# EAGLE schematic ESP-WROOM-32-Breakout (EAGLE 9.3.0)
REV: 1
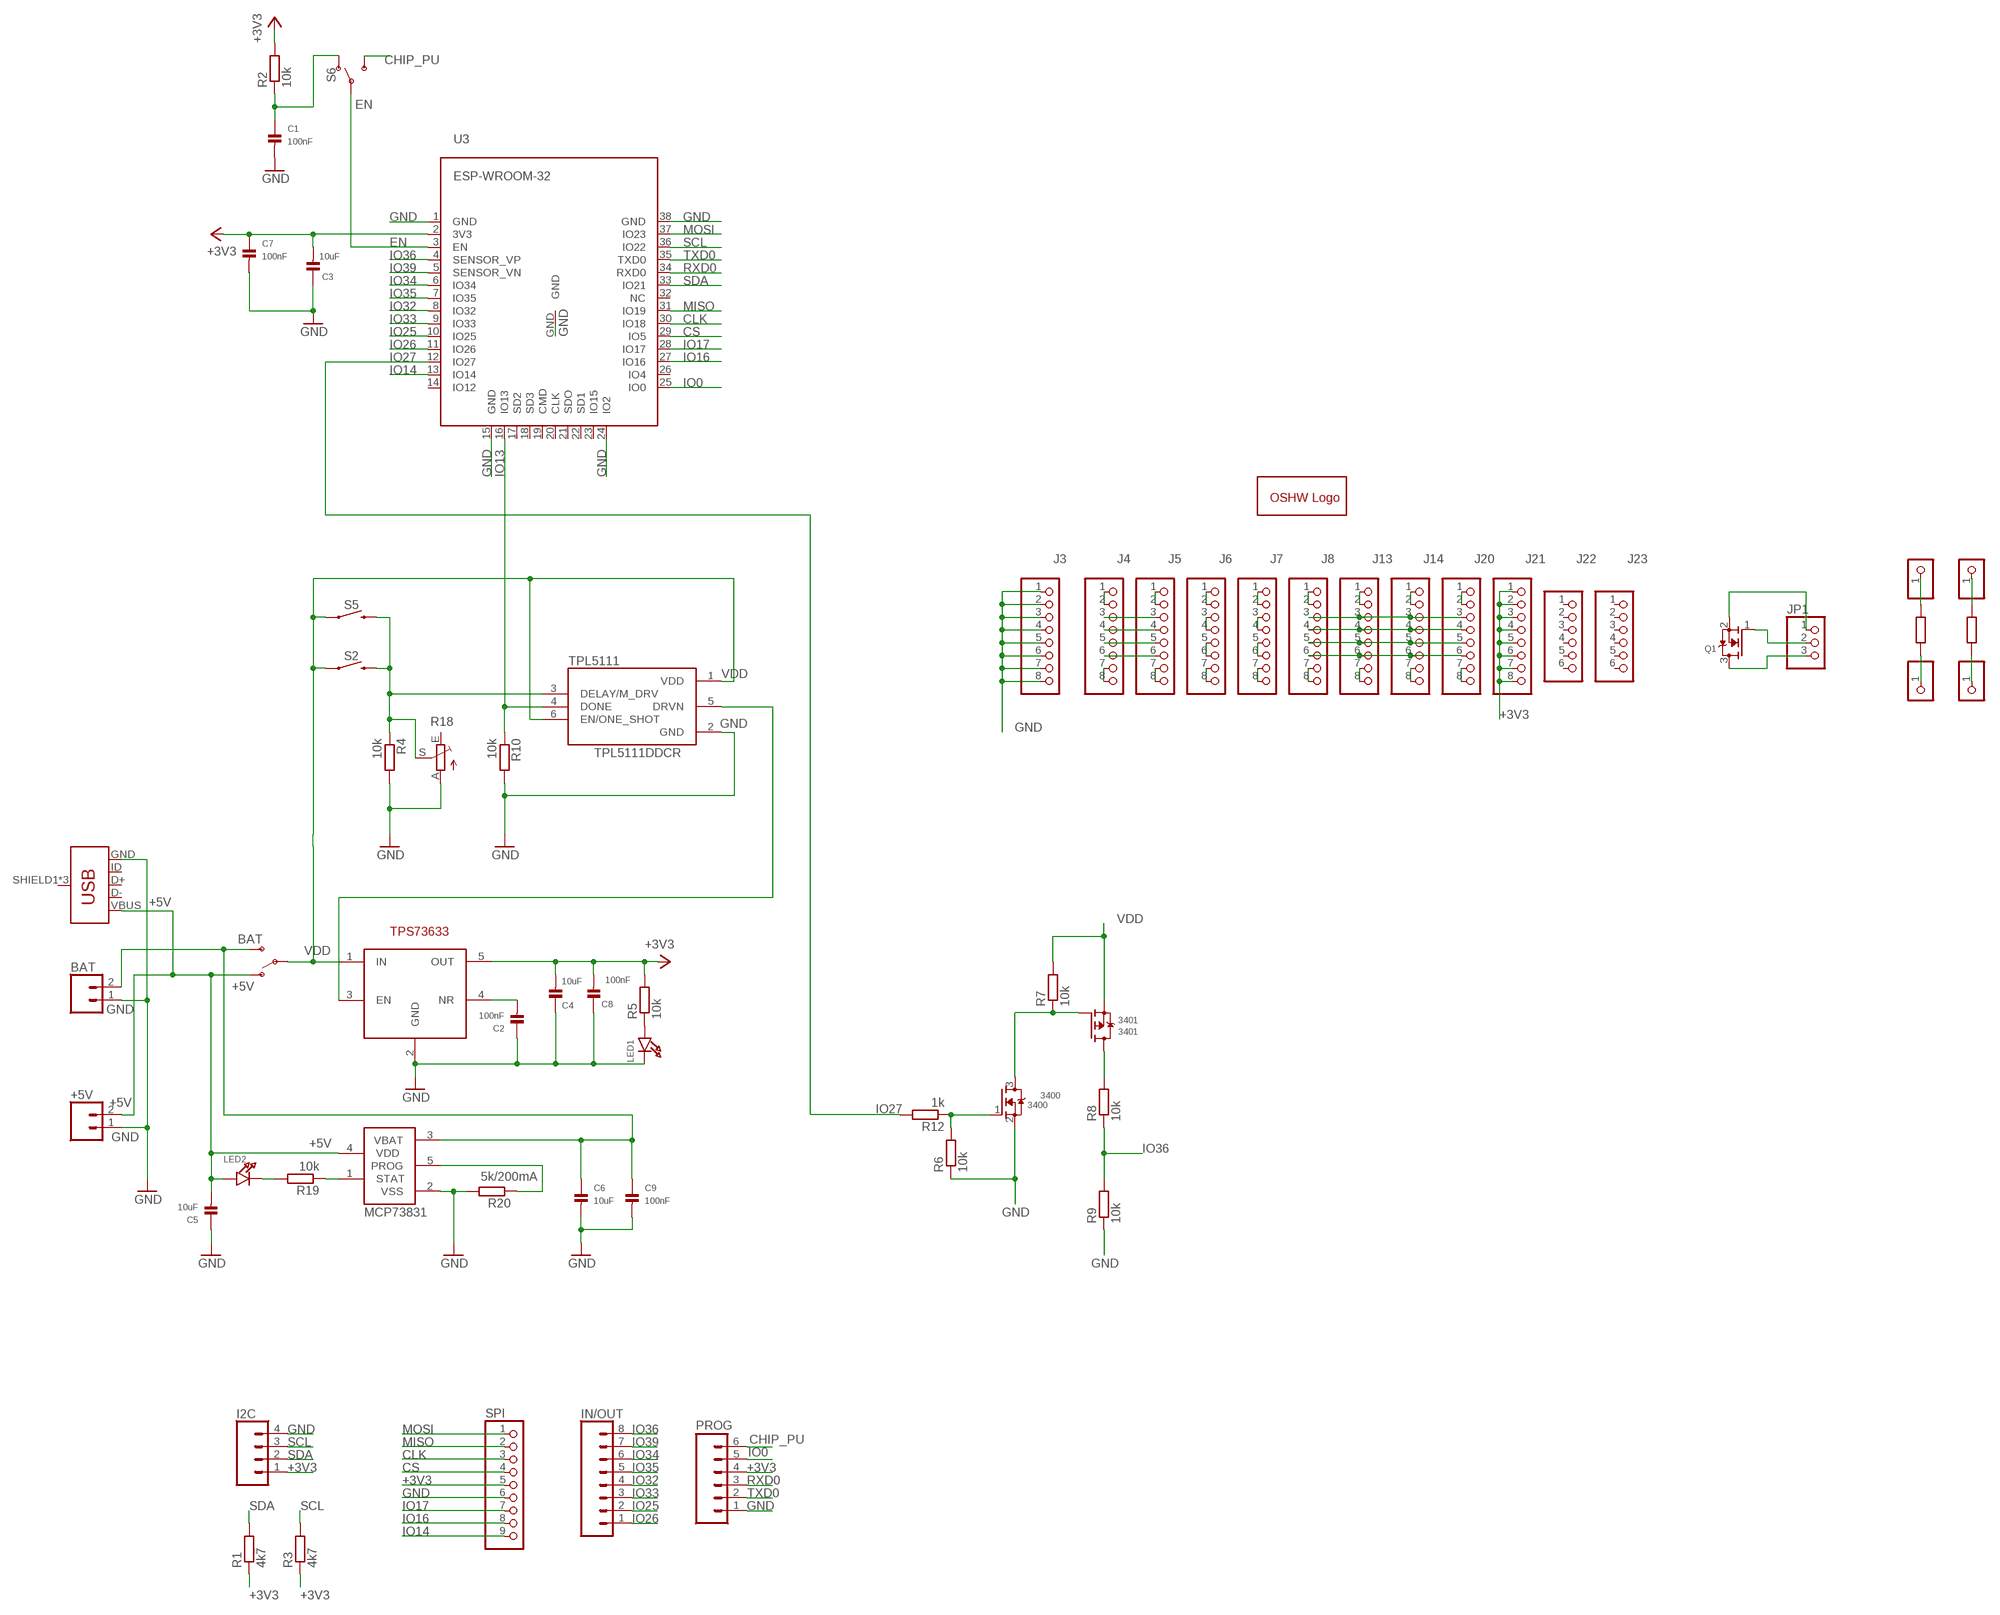
[diagram p0: schematic, sheet 1]

## Parts
3400  3400  MOSFET-NWIDE  [SOT23-WIDE]
3401  3401  MOSFET-PWIDE  [SOT23-WIDE]
+5V  CONN_02  [1X02]
BAT  CONN_02  [1X02]
C1  100nF  CAP_CERAMIC1206  [1206]
C2  100nF  CAP_CERAMIC1206  [1206]
C3  10uF  CAP_CERAMIC1206  [1206]
C4  10uF  CAP_CERAMIC1206  [1206]
C5  10uF  CAP_CERAMIC1206  [1206]
C6  10uF  CAP_CERAMIC1206  [1206]
C7  100nF  CAP_CERAMIC1206  [1206]
C8  100nF  CAP_CERAMIC1206  [1206]
C9  100nF  CAP_CERAMIC1206  [1206]
GOLD_ORB_SM1  OSHWLOGOLOGO8MM  [OSHW_8MM]
I2C  CONN_041X04_NO_SILK  [1X04_NO_SILK]
IN/OUT  CONN_08NO_SILK_FEMALE_PTH  [1X08_NO_SILK]
J1  USB_MICRO-B_FEMALE-SMT  [USB-B-MICRO-SMD]
J3  HEADER-1X8ROUND  [1X08_ROUND]
J4  HEADER-1X8ROUND  [1X08_ROUND]
J5  HEADER-1X8ROUND  [1X08_ROUND]
J6  HEADER-1X8ROUND  [1X08_ROUND]
J7  HEADER-1X8ROUND  [1X08_ROUND]
J8  HEADER-1X8ROUND  [1X08_ROUND]
J13  HEADER-1X8ROUND  [1X08_ROUND]
J14  HEADER-1X8ROUND  [1X08_ROUND]
J20  HEADER-1X8ROUND  [1X08_ROUND]
J21  HEADER-1X8ROUND  [1X08_ROUND]
J22  HEADER-1X670MIL  [1X06_ROUND_70]
J23  HEADER-1X670MIL  [1X06_ROUND_70]
JP1  HEADER-1X376MIL  [1X03_ROUND_76]
JP2  HEADER-1X12MM  [1X01_2MM]
JP3  HEADER-1X12MM  [1X01_2MM]
JP4  HEADER-1X12MM  [1X01_2MM]
JP5  HEADER-1X12MM  [1X01_2MM]
LED1  LED1206  [CHIPLED_1206]
LED2  LED1206  [CHIPLED_1206]
PROG  CONN_06NO_SILK_NO_POP  [1X06_NO_SILK]
Q1  MOSFET-NWIDE  [SOT23-WIDE]
R1  4k7  R-EU_R1206  [R1206]
R2  10k  R-EU_R1206  [R1206]
R3  4k7  R-EU_R1206  [R1206]
R4  10k  R-EU_R1206  [R1206]
R5  10k  R-EU_R1206  [R1206]
R6  10k  R-EU_R1206  [R1206]
R7  10k  R-EU_R1206  [R1206]
R8  10k  R-EU_R1206  [R1206]
R9  10k  R-EU_R1206  [R1206]
R10  10k  R-EU_R1206  [R1206]
R11  10k  R-EU_R1206  [R1206]
R12  1k  R-EU_R1206  [R1206]
R13  10k  R-EU_R1206  [R1206]
R18  TRIM_EU-CT6  [CT6]
R19  10k  R-EU_R1206  [R1206]
R20  5k/200mA  R-EU_R1206  [R1206]
S2  MOMENTARY-SWITCH-SPST-SMD-6.2MM-TALL  [TACTILE_SWITCH_SMD_6.2MM_TALL]
S3  SWITCH-SPDT-PTH-11.6X4.0MM  [SWITCH_SPDT_PTH_11.6X4.0MM]
S5  MOMENTARY-SWITCH-SPST-PTH-RIGHT-ANGLE-KIT  [TACTILE_SWITCH_PTH_RIGHT_ANGLE_KIT]
S6  SWITCH-SPDT-PTH-11.6X4.0MM  [SWITCH_SPDT_PTH_11.6X4.0MM]
SPI  HEADER-1X970MIL  [1X09_ROUND_70]
TPL5111  TPL5111DDCR  [SOT95P280X110-6N]
TPS73633  TPS73633DBVR  [SOT23-DBV]
U3  ESP-WROOM-32  [ESP-WROOM-32]
U$1  MCP73831  [SOT23-5L]

## Nets
+3V3: C3.2 C4.2 C7.1 C8.2 I2C.1 J21.1 J21.2 J21.3 J21.4 J21.5 J21.6 J21.7 J21.8 PROG.4 R1.1 R2.2 R3.1 R5.2 SPI.5 TPS73633.5(OUT) U3.2(3V3)
+5V: +5V.2 C5.2 J1.VBUS LED2.A S3.1(O) U$1.4(VDD)
BAT: BAT.2 C6.1 C9.1 S3.3(S) U$1.3(VBAT)
CHIP_PU: PROG.6 S6.3(S)
CLK: SPI.3 U3.30(IO18)
CS: SPI.4 U3.29(IO5)
EN: S6.2(P) U3.3(EN)
GND [gnd]: 3400.2(S) +5V.1 BAT.1 C1.2 C2.1 C3.1 C4.1 C5.1 C6.2 C7.2 C8.1 C9.2 I2C.4 J1.GND J3.1 J3.2 J3.3 J3.4 J3.5 J3.6 J3.7 J3.8 LED1.C PROG.1 R4.2 R6.1 R9.1 R10.2 R18.A R20.2 SPI.6 TPL5111.2(GND) TPS73633.2(GND) U3.1(GND) U3.15(GND) U3.24(IO2) U3.38(GND) U3.GND U$1.2(VSS)
IO0: PROG.5 U3.25(IO0)
IO13: R10.1 TPL5111.4(DONE) U3.16(IO13)
IO14: SPI.9 U3.13(IO14)
IO16: SPI.8 U3.27(IO16)
IO17: SPI.7 U3.28(IO17)
IO25: IN/OUT.2 U3.10(IO25)
IO26: IN/OUT.1 U3.11(IO26)
IO27: R12.2 U3.12(IO27)
IO32: IN/OUT.4 U3.8(IO32)
IO33: IN/OUT.3 U3.9(IO33)
IO34: IN/OUT.6 U3.6(IO34)
IO35: IN/OUT.5 U3.7(IO35)
IO36: IN/OUT.8 R8.1 R9.2 U3.4(SENSOR_VP)
IO39: IN/OUT.7 U3.5(SENSOR_VN)
MISO: SPI.2 U3.31(IO19)
MOSI: SPI.1 U3.37(IO23)
N$1: TPL5111.5(DRVN) TPS73633.3(EN)
N$2: JP1.1 Q1.2(S)
N$3: C2.2 TPS73633.4(NR)
N$4: R4.1 R18.S S2.B2 S5.2 TPL5111.3(DELAY/M_DRV)
N$5: LED1.A R5.1
N$6: JP1.2 Q1.1(G)
N$7: JP1.3 Q1.3(D)
N$8: 3400.3(D) 3401.1(G) R7.1
N$9: JP2.1 R11.2
N$10: 3401.3(D) R8.2
N$11: JP3.1 R11.1
N$12: JP4.1 R13.2
N$13: JP5.1 R13.1
N$15: C1.1 R2.1 S6.1(O)
N$16: R19.1 U$1.1(STAT)
N$18: 3400.1(G) R6.2 R12.1
N$19: J4.1 J4.2
N$20: J5.1 J5.2
N$21: J4.3 J5.3
N$22: J4.4 J5.4
N$23: J4.5 J5.5
N$24: J4.6 J5.6
N$25: J4.7 J4.8
N$26: J5.7 J5.8
N$27: J7.1 J7.2
N$28: J7.3 J7.4
N$29: J7.5 J7.6
N$30: J7.7 J7.8
N$31: J8.7 J8.8
N$32: R20.1 U$1.5(PROG)
N$34: J20.7 J20.8
N$36: J6.3 J6.4
N$37: J8.1 J8.2
N$38: J6.1 J6.2
N$44: J13.1 J13.2
N$45: J8.3 J13.3 J14.3 J20.3
N$46: J8.4 J13.4 J14.4 J20.4
N$47: J8.5 J13.5 J14.5 J20.5
N$48: J8.6 J13.6 J14.6 J20.6
N$49: J6.7 J6.8
N$50: J13.7 J13.8
N$51: J14.7 J14.8
N$52: J14.1 J14.2
N$53: J20.1 J20.2
N$54: J6.5 J6.6
N$68: LED2.C R19.2
RXD0: PROG.3 U3.34(RXD0)
SCL: I2C.3 R3.2 U3.36(IO22)
SDA: I2C.2 R1.2 U3.33(IO21)
TXD0: PROG.2 U3.35(TXD0)
VDD [vcc]: 3401.2(S) R7.2 S2.A2 S3.2(P) S5.1 TPL5111.1(VDD) TPL5111.6(EN/ONE_SHOT) TPS73633.1(IN)
Unconnected: J1.D+ J1.D- J1.ID J1.SHIELD1(SHIELD) J1.SHIELD2(SHIELD) J1.SHIELD3(SHIELD) J22.1 J22.2 J22.3 J22.4 J22.5 J22.6 J23.1 J23.2 J23.3 J23.4 J23.5 J23.6 R18.E U3.14(IO12) U3.17(SD2) U3.18(SD3) U3.19(CMD) U3.20(CLK) U3.21(SDO) U3.22(SD1) U3.23(IO15) U3.26(IO4) U3.32(NC)

## Library data of the parts
3400 Q1 = microbuilder:MOSFET-N: N-Channel Mosfet LEGEND VDS: Voltage Drain-Source ID: Drain Current RDS(ON): Drain-Source On-State Resistance VGS(TH): Gate-Source Threshold Voltage CISS: Drain-Source Input Capacitance SOT-23 Name VDS ID RDS(ON) VGS(TH) CISS Order Number 2N7002E 60V 260mA 2.5 Ohm 2.5V @ 250uA 26.7pF @ 25V 2N7002ET1GOSTR-ND BSH103 30V 850mA 400 mOhm 400mV @ 1mA 83pF @ 24V BSH103,235-ND BSS138 60V 320mA 1.6 Ohm 1.5V @ 250uA 50pF @ 10V Mouser: 771-BSS138PW115 DMN2075U-7 20V 4.2A 38 mOhm 1V @ 250 uA 594.3pF @ 10V DMN2075U-7DICT-ND * BSS138 good choice for I2C level-shifting
3401 = microbuilder:MOSFET-P: P-Channel Mosfet LEGEND VDS: Voltage Drain-Source ID: Drain Current RDS(ON): Drain-Source On-State Resistance VGS(TH): Gate-Source Threshold Voltage CISS: Drain-Source Input Capacitance SOT-23 Name VDS ID RDS(ON) VGS(TH) CISS Order Number IRLML5103 30V 760mA 600 mOhm -- 75pF @ 25V Digikey: IRLML5103PBFCT-ND IRLML6401 12V 4.3A 50 mOhm 950mV @ 250µA 830pF @ 10V Digikey: IRLML6401PBFTR-ND NTR0202PL 20V 400mA 800 mOhm 2.3V @ 250uA 70pF @ 5V Digikey: NTR0202PLT1GOSTR-ND NTR4101PT1G 20V 1.8A 85 mOhm 1.2V @ 250uA 675pF @ 10V Digikey: NTR4101PT1GOSCT-ND DMP2004K 20V 600mA 900 mOhm 1V @ 250uA 175pF @ 16V Digikey: DMP2004KDICT-ND PMV65XP 20V 3.9A 76 mOhm 950mV @ 1mA 725pF @ 20V Digikey: 568-2358-2-ND TO-252 Name VDS ID RDS(ON) VGS(TH) CISS Order Number AOD417 30V 25A 34 mOhm 3V @ 250µA 920pF @ 15V Digikey: 785-1106-2-ND
+5V BAT = SparkFun-Connectors:CONN_02: Multi connection point. Often used as Generic Header-pin footprint for 0.1 inch spaced/style header connections On any of the 0.1 inch spaced packages, you can populate with these: Break Away Headers - Straight <https://www.sparkfun.com/products/116> (PRT-00116) Break Away Male Headers - Right Angle <https://www.sparkfun.com/products/553> (PRT-00553) Female Headers <https://www.sparkfun.com/products/115> (PRT-00115) Break Away Headers - Machine Pin <https://www.sparkfun.com/products/117> (PRT-00117) Break Away Female Headers - Swiss Machine Pin <https://www.sparkfun.com/products/743> (PRT-00743) For SCREWTERMINALS and SPRING TERMINALS visit here: Screw Terimnals on SparkFun.com <https://www.sparkfun.com/search/results?term=Screw+Terminals> (5mm/3.5mm/2.54mm spacing) This device is also useful as a general connection point to wire up your design to another part of your project. Our various solder wires solder well into these plated through hole pads. Hook-Up Wire - Assortment (Stranded, 22 AWG) <https://www.sparkfun.com/products/11375> (PRT-11375) Hook-Up Wire - Assortment (Solid Core, 22 AWG) <https://www.sparkfun.com/products/11367> (PRT-11367) View the entire wire category on our website here <https://www.sparkfun.com/categories/141> Special notes: Molex polarized connector foot print use with: PRT-08233 with associated crimp pins and housings. 2.54_SCREWTERM for use with PRT-10571. 3.5mm Screw Terminal footprints for PRT-08084 5mm Screw Terminal footprints for use with PRT-08432
C1-C9 = microbuilder:CAP_CERAMIC: Ceramic Capacitors 0402 - 0402 Surface Mount Capacitors 16pF 50V 5% [Digikey: 445-4899-2-ND] 18pF 50V 5% [Digikey: 490-1281-2-ND] 22pF 50V 5% [Digikey: 490-1283-2-ND] 68pF 50V 5% [Digikey: 490-1289-2-ND] 0.1uF 10V 10% [Digikey: 490-1318-2-ND] 1.0uF 6.3V 10% [Digikey: 490-1320-2-ND] 0603 - 0603 Surface Mount Capacitors 16 pF 50V 5% [Digikey: 445-5051-2-ND] 22 pF 50V [Digikey: PCC220ACVTR-ND] 33 pF 50V 5% [Digikey: 490-1415-1-ND] 56pF 50V 5% [Digikey: 490-1421-1-ND] 220pF 50V 5% [Digikey: 445-1285-1-ND] 680 pF 50V 2200 pF 50V 5% C0G [Digikey: 445-1297-1-ND] 5600 pF 100V 5% X7R [Digikey: 478-3711-1-ND] 0.1 µF 25V 10% [Digikey: PCC2277TR-ND] 0.22 µF 16V 10% X7R [Digikey: 445-1318-1-ND] 1.0 µF 25V 10% [Digikey: 445-5146-2-ND] 0603 - RF Specific 3pF 250V +/-0.1pF RF [Digikey: 712-1347-1-ND] 18 pF 250V 5% [Digikey: 478-3505-1-ND or 712-1322-1-ND] 56 pF 250V 5% C0G RF [Digikey: 490-4867-1-ND] 68 pF 250V RF [Digikey: 490-4868-1-ND] 0805 - 0805 Surface Mount Capacitors 220 pF 250V 2% RF Ceramic Capacitor [Digikey: 712-1398-1-ND] 1000 pF 50V 2% NP0 Ceramic Capacitor [Digikey: 478-3760-1-ND] 0.1 µF 25V 10% Ceramic Capacitor [Digikey: PCC1828TR-ND] 1.0 µF 16V 10% Ceramic Capacitor[Digikey: 490-1691-2-ND] 10.0 µF 10V 10% Ceramic Capacitor[Digikey: 709-1228-1-ND] 10.0 uF 16V 10% Ceramic Capacitor [Digikey: 478-5165-2-ND] 47 uF 6.3V 20% Ceramic Capacitor [Digikey: 587-1779-1-ND or 399-5506-1-ND] 1206 - 1206 Surface Mount Capacitors 47uF 10V 20% Ceramic Capacitor [Digikey: 490-5528-1-ND or 399-5508-1-ND or 445-6010-1-ND] 100uF 6.3V -20%, +80% Y5V Ceramic Capacitor (Digikey: 490-4512-1-ND, Mouser: 81-GRM31CF50J107ZE1L)
GOLD_ORB_SM1 = oshw:OSHWLOGO: The OSHW logo for PCB layout
I2C = SparkFun-Connectors:CONN_04: Multi connection point. Often used as Generic Header-pin footprint for 0.1 inch spaced/style header connections On any of the 0.1 inch spaced packages, you can populate with these: Break Away Headers - Straight <https://www.sparkfun.com/products/116> (PRT-00116) Break Away Male Headers - Right Angle <https://www.sparkfun.com/products/553> (PRT-00553) Female Headers <https://www.sparkfun.com/products/115> (PRT-00115) Break Away Headers - Machine Pin <https://www.sparkfun.com/products/117> (PRT-00117) Break Away Female Headers - Swiss Machine Pin <https://www.sparkfun.com/products/743> (PRT-00743) For SCREWTERMINALS and SPRING TERMINALS visit here: Screw Terimnals on SparkFun.com <https://www.sparkfun.com/search/results?term=Screw+Terminals> (5mm/3.5mm/2.54mm spacing) This device is also useful as a general connection point to wire up your design to another part of your project. Our various solder wires solder well into these plated through hole pads. Hook-Up Wire - Assortment (Stranded, 22 AWG) <https://www.sparkfun.com/products/11375> (PRT-11375) Hook-Up Wire - Assortment (Solid Core, 22 AWG) <https://www.sparkfun.com/products/11367> (PRT-11367) View the entire wire category on our website here <https://www.sparkfun.com/categories/141> Special notes: Molex polarized connector foot print use with SKU : PRT-08231 with associated crimp pins and housings. 1MM SMD Version SKU: PRT-10208; PROD_ID: CONN-09696
IN/OUT = SparkFun-Connectors:CONN_08: Multi connection point. Often used as Generic Header-pin footprint for 0.1 inch spaced/style header connections On any of the 0.1 inch spaced packages, you can populate with these: Break Away Headers - Straight <https://www.sparkfun.com/products/116> (PRT-00116) Break Away Male Headers - Right Angle <https://www.sparkfun.com/products/553> (PRT-00553) Female Headers <https://www.sparkfun.com/products/115> (PRT-00115) Break Away Headers - Machine Pin <https://www.sparkfun.com/products/117> (PRT-00117) Break Away Female Headers - Swiss Machine Pin <https://www.sparkfun.com/products/743> (PRT-00743) Arduino Stackable Header - 8 Pin <https://www.sparkfun.com/products/9279> (PRT-09279) For SCREWTERMINALS and SPRING TERMINALS visit here: Screw Terimnals on SparkFun.com <https://www.sparkfun.com/search/results?term=Screw+Terminals> (5mm/3.5mm/2.54mm spacing) This device is also useful as a general connection point to wire up your design to another part of your project. Our various solder wires solder well into these plated through hole pads. Hook-Up Wire - Assortment (Stranded, 22 AWG) <https://www.sparkfun.com/products/11375> (PRT-11375) Hook-Up Wire - Assortment (Solid Core, 22 AWG) <https://www.sparkfun.com/products/11367> (PRT-11367) View the entire wire category on our website here <https://www.sparkfun.com/categories/141> Special notes: Molex polarized connector foot print use with SKU : PRT-08231 with associated crimp pins and housings. 1MM SMD Version SKU: PRT-10208 NOTES ON THE VARIANTS LOCK and LOCK_LONGPADS... This footprint was designed to help hold the alignment of a through-hole component (i.e. 6-pin header) while soldering it into place. You may notice that each hole has been shifted either up or down by 0.005 of an inch from it's more standard position (which is a perfectly straight line). This slight alteration caused the pins (the squares in the middle) to touch the edges of the holes. Because they are alternating, it causes a "brace" to hold the component in place. 0.005 has proven to be the perfect amount of "off-center" position when using our standard breakaway headers. Although looks a little odd when you look at the bare footprint, once you have a header in there, the alteration is very hard to notice. Also,if you push a header all the way into place, it is covered up entirely on the bottom side.; PROD_ID: CONN-08438
J1 = SparkFun-Connectors:USB_MICRO-B: USB Type Micro-B Connector Male/female and PTH/SMT variants SparkFun Products: SparkFun microB USB Breakout <https://www.sparkfun.com/products/12035> SparkFun USB microB Plug Breakout <https://www.sparkfun.com/products/10031> SparkFun ESP8266 Thing <https://www.sparkfun.com/products/13231>; PROD_ID: CONN-11752
J3-J8 J13 J14 J20 J21 = microbuilder:HEADER-1X8: PIN HEADER
J22 J23 = microbuilder:HEADER-1X6: PIN HEADER
JP1 = microbuilder:HEADER-1X3: PIN HEADER
JP2-JP5 = microbuilder:HEADER-1X1: PIN HEADER
LED1 LED2 = microbuilder:LED: LED 0603 - 0603 Surface Mount Package 2mA: Green LED - Low Power (3.9mcd, 2ma, 1.7Vf) - Digikey: 475-2709-2-ND Orange LED - Low Power (9.8mcd, 2ma, 1.8Vf) - Digikey: 475-1194-2-ND Red LED - Low Power (5mcd, 2ma, 1.8Vf) - Digikey: 475-1195-2-ND Yellow LED - Low Power (7mcd, 2ma, 1.8Vf) - Digikey: 475-1196-2-ND 5mA: Blue LED - Low Power (17mcd, 5ma, 2.9Vf) - Digikey: LNJ937W8CRACT-ND 0805 - 0805 Surface Mount Package 2mA: Red LED (8.8mcd, 2mA, 1.8Vf, Clear) - Low Power [Digikey: 475-2510-1-ND] Green LED (5mcd, 2mA, 1.8Vf, Clear) - Low Power [Digikey: 475-2730-1-ND] Yellow LED (11.3mcd, 2mA, 1.8Vf, Clear) - Low Power [Digikey: 475-2555-1-ND] 20mA: Red LED (104mcd, 20mA, Diffused) - LS R976 [Digikey: 475-1278-6-ND] Red LED (12mcd, 20mA, 2.0Vf, Clear) - APT2012EC [Digikey: 754-1128-1-ND] Green LED (15mcd, 20mA, 2.2Vf, Clear) - APT2012GC [Digikey: 754-1131-1-ND] Orange LED (160mcd, 20mA, 2.1Vf, Clear) - APT2012SECK [Digikey: 754-1130-1-ND] 1206 - 1206 Surface Mount Package Green LED (26mcd, 20mA, Diffused) - LG N971 [Digikey: 475-1407-6-ND] Red LED (15mcd, 20mA, Diffused) - LH N974 [Digikey: 475-1416-6-ND]
PROG = SparkFun-Connectors:CONN_06: Multi connection point. Often used as Generic Header-pin footprint for 0.1 inch spaced/style header connections On any of the 0.1 inch spaced packages, you can populate with these: Break Away Headers - Straight <https://www.sparkfun.com/products/116> (PRT-00116) Break Away Male Headers - Right Angle <https://www.sparkfun.com/products/553> (PRT-00553) Female Headers <https://www.sparkfun.com/products/115> (PRT-00115) Break Away Headers - Machine Pin <https://www.sparkfun.com/products/117> (PRT-00117) Break Away Female Headers - Swiss Machine Pin <https://www.sparkfun.com/products/743> (PRT-00743) Arduino Stackable Header - 6 Pin <https://www.sparkfun.com/products/9280> (PRT-09280) For SCREWTERMINALS and SPRING TERMINALS visit here: Screw Terimnals on SparkFun.com <https://www.sparkfun.com/search/results?term=Screw+Terminals> (5mm/3.5mm/2.54mm spacing) This device is also useful as a general connection point to wire up your design to another part of your project. Our various solder wires solder well into these plated through hole pads. Hook-Up Wire - Assortment (Stranded, 22 AWG) <https://www.sparkfun.com/products/11375> (PRT-11375) Hook-Up Wire - Assortment (Solid Core, 22 AWG) <https://www.sparkfun.com/products/11367> (PRT-11367) View the entire wire category on our website here <https://www.sparkfun.com/categories/141>
R1-R13 R19 R20 = rcl:R-EU_: RESISTOR, European symbol; SPICEPREFIX: R
R18 = pot:TRIM_EU-: POTENTIOMETER
S2 = SparkFun-Switches:MOMENTARY-SWITCH-SPST: Momentary Switch (Pushbutton) - SPST Normally-open (NO) SPST momentary switches (buttons, pushbuttons). Variants PTH-12MM - 12mm square, through-hole Momentary Pushbutton Switch - 12mm Square <https://www.sparkfun.com/products/9190> (COM-09190) PTH-6.0MM, PTH-6.0MM-KIT - 6.0mm square, through-hole Mini Pushbutton Switch <https://www.sparkfun.com/products/97> (COM-00097) KIT package intended for soldering kit's - only one side of pads' copper is exposed. PTH-RIGHT-ANGLE-KIT - Right-angle, through-hole Right Angle Tactile Button <https://www.sparkfun.com/products/10791> - Used on SparkFun BigTime Watch Kit <https://www.sparkfun.com/products/11734> SMD-12MM - 12mm square, surface-mount Tactile Button - SMD (12mm) <https://www.sparkfun.com/products/12993> (COM-12993) Used on SparkFun PicoBoard <https://www.sparkfun.com/products/11888> SMD-4.5MM - 4.5mm Square Trackball Switch Used on SparkFun Blackberry Trackballer Breakout <https://www.sparkfun.com/products/13169> SMD-4.6MMX2.8MM - 4.60mm x 2.80mm, surface mount Used on SparkFun SAMD21 Mini Breakout <https://www.sparkfun.com/products/13664> SMD-5.2MM, SMD-5.2-REDUNDANT - 5.2mm square, surface-mount Mini Pushbutton Switch - SMD <https://www.sparkfun.com/products/8720> (COM-08720) Used on Arduino Pro Mini <https://www.sparkfun.com/products/11114> REDUNDANT package connects both switch circuits together SMD-6.0X3.5MM - 6.0 x 3.5mm, surface mount Momentary Reset Switch SMD <https://www.sparkfun.com/products/8229> (COM-08229) SMD-6.2MM-TALL - 6.2mm square, surface mount Tactile Button - SMD (6mm) <https://www.sparkfun.com/products/12992> Used on SparkFun Digital Sandbox <https://www.sparkfun.com/products/12651> SMD-RIGHT-ANGLE - Right-angle, surface mount Used on SparkFun Block for Intel® Edison - Arduino <https://www.sparkfun.com/products/13036>; PROD_ID: SWCH-11966; SF_SKU: COM-12992
S3 S6 = SparkFun-Switches:SWITCH-SPDT: Single Pole, Double Throw (SPDT) Switch Single-pole, double-throw (SPDT) switch. Variant Overview SMD-AYZ0202 Surface Mount DPDT Switch <https://www.sparkfun.com/products/597> (COM-00597) Used on e.g. LilyPad Arduino USB - ATmega32U4 Board <https://www.sparkfun.com/products/12049> PTH-11.6X4.0MM SPDT Mini Power Switch <https://www.sparkfun.com/products/102> (COM-00102) Used on e.g. SparkFun Simon Says - Through-Hole Soldering Kit <https://www.sparkfun.com/products/10547> (KIT-10547) PTH-11.6X4.0MM-KIT KIT version of SPDT Mini Power Switch - Simplifies soldering by removing tStop of switch pins - only one side can be soldered. PTH-11.6X4.0MM-LOCK LOCK version of SPDT Mini Power Switch - Offset pins hold switch in place for easier soldering. SMD-RIGHT-ANGLE Surface Mount Right Angle Switch <https://www.sparkfun.com/products/10860> (COM-10860) Used on e.g. SparkFun ESP8266 Thing <https://www.sparkfun.com/products/13231>; PROD_ID: SWCH-08261; SF_SKU: COM-00102
S5 = SparkFun-Switches:MOMENTARY-SWITCH-SPST: Momentary Switch (Pushbutton) - SPST Normally-open (NO) SPST momentary switches (buttons, pushbuttons). Variants PTH-12MM - 12mm square, through-hole Momentary Pushbutton Switch - 12mm Square <https://www.sparkfun.com/products/9190> (COM-09190) PTH-6.0MM, PTH-6.0MM-KIT - 6.0mm square, through-hole Mini Pushbutton Switch <https://www.sparkfun.com/products/97> (COM-00097) KIT package intended for soldering kit's - only one side of pads' copper is exposed. PTH-RIGHT-ANGLE-KIT - Right-angle, through-hole Right Angle Tactile Button <https://www.sparkfun.com/products/10791> - Used on SparkFun BigTime Watch Kit <https://www.sparkfun.com/products/11734> SMD-12MM - 12mm square, surface-mount Tactile Button - SMD (12mm) <https://www.sparkfun.com/products/12993> (COM-12993) Used on SparkFun PicoBoard <https://www.sparkfun.com/products/11888> SMD-4.5MM - 4.5mm Square Trackball Switch Used on SparkFun Blackberry Trackballer Breakout <https://www.sparkfun.com/products/13169> SMD-4.6MMX2.8MM - 4.60mm x 2.80mm, surface mount Used on SparkFun SAMD21 Mini Breakout <https://www.sparkfun.com/products/13664> SMD-5.2MM, SMD-5.2-REDUNDANT - 5.2mm square, surface-mount Mini Pushbutton Switch - SMD <https://www.sparkfun.com/products/8720> (COM-08720) Used on Arduino Pro Mini <https://www.sparkfun.com/products/11114> REDUNDANT package connects both switch circuits together SMD-6.0X3.5MM - 6.0 x 3.5mm, surface mount Momentary Reset Switch SMD <https://www.sparkfun.com/products/8229> (COM-08229) SMD-6.2MM-TALL - 6.2mm square, surface mount Tactile Button - SMD (6mm) <https://www.sparkfun.com/products/12992> Used on SparkFun Digital Sandbox <https://www.sparkfun.com/products/12651> SMD-RIGHT-ANGLE - Right-angle, surface mount Used on SparkFun Block for Intel® Edison - Arduino <https://www.sparkfun.com/products/13036>; PROD_ID: CONN-10672; SF_SKU: COM-10791
SPI = microbuilder:HEADER-1X9: PIN HEADER
TPL5111 = TPL5111DDCR:TPL5111DDCR: Ultra Low Power System Timer (35 nA) for Power Gating in duty cycled applications 6-SOT -40 to 105; DESCRIPTION: Ultra Low Power System Timer _35 nA_ for Power Gating in duty cycled applications 6-SOT -40 to 105; DIGI-KEY_PART_NUMBER: 296-46226-1-ND; DIGI-KEY_PURCHASE_URL: https://www.digikey.com.ua/product-detail/en/texas-instruments/TPL5111DDCR/296-46226-1-ND/7033401?utm_source=snapeda&utm_medium=aggregator&utm_campaign=symbol; MF: Texas Instruments; MP: TPL5111DDCR; PACKAGE: SOT-23 Texas Instruments
TPS73633 = TPS73633DBVR:TPS73633DBVR: 3.3V LDO regulator. Package footprint not verified!!; DESCRIPTION: Single Output LDO, 400mA, Adj._1.2 to 5.5V_, Cap free, Low Noise, Reverse Current Protection 5-SOT-23 -40 to 125; DIGI-KEY_PART_NUMBER: 296-27064-1-ND; DIGI-KEY_PURCHASE_URL: https://www.digikey.com.ua/product-detail/en/texas-instruments/TPS73633DBVR/296-27064-1-ND/2255336?utm_source=snapeda&utm_medium=aggregator&utm_campaign=symbol; MF: Texas Instruments; MP: TPS73633DBVR; PACKAGE: SOT-23 Texas Instruments
U3 = esp32:ESP-WROOM-32
U$1 = mcp73831:MCP73831: Miniature Single-Cell, Fully Integrated Li-Ion, Li-Polymer Charge Management Controllers

## Net classes
0 default: width 0.254 mm, drill 0.305 mm, clearance 0.205 mm
1 gnd: width 0.635 mm, drill 0.635 mm, clearance 0.205 mm to class 0, clearance 0.254 mm
2 vcc: width 0.406 mm, drill 0.406 mm, clearance 0.205 mm to class 0, clearance 0.205 mm to class 1, clearance 0.254 mm